# Altium schematic sheet SmartToy Main Board REV02 Block Diagram.SchDoc: Smart Toy REV01 Block Diagram
size A3; DrawnBy: Manh Ngo Van; Engineer: Manh Ngo Van; Organization: Altium Limited; Address1: L3, 12a Rodborough Rd; Address2: Frenchs Forest; Address3: NSW; Address4: Australia 2086; DocumentNumber: 1; Revision: 1.0; SheetNumber: 1; SheetTotal: 2
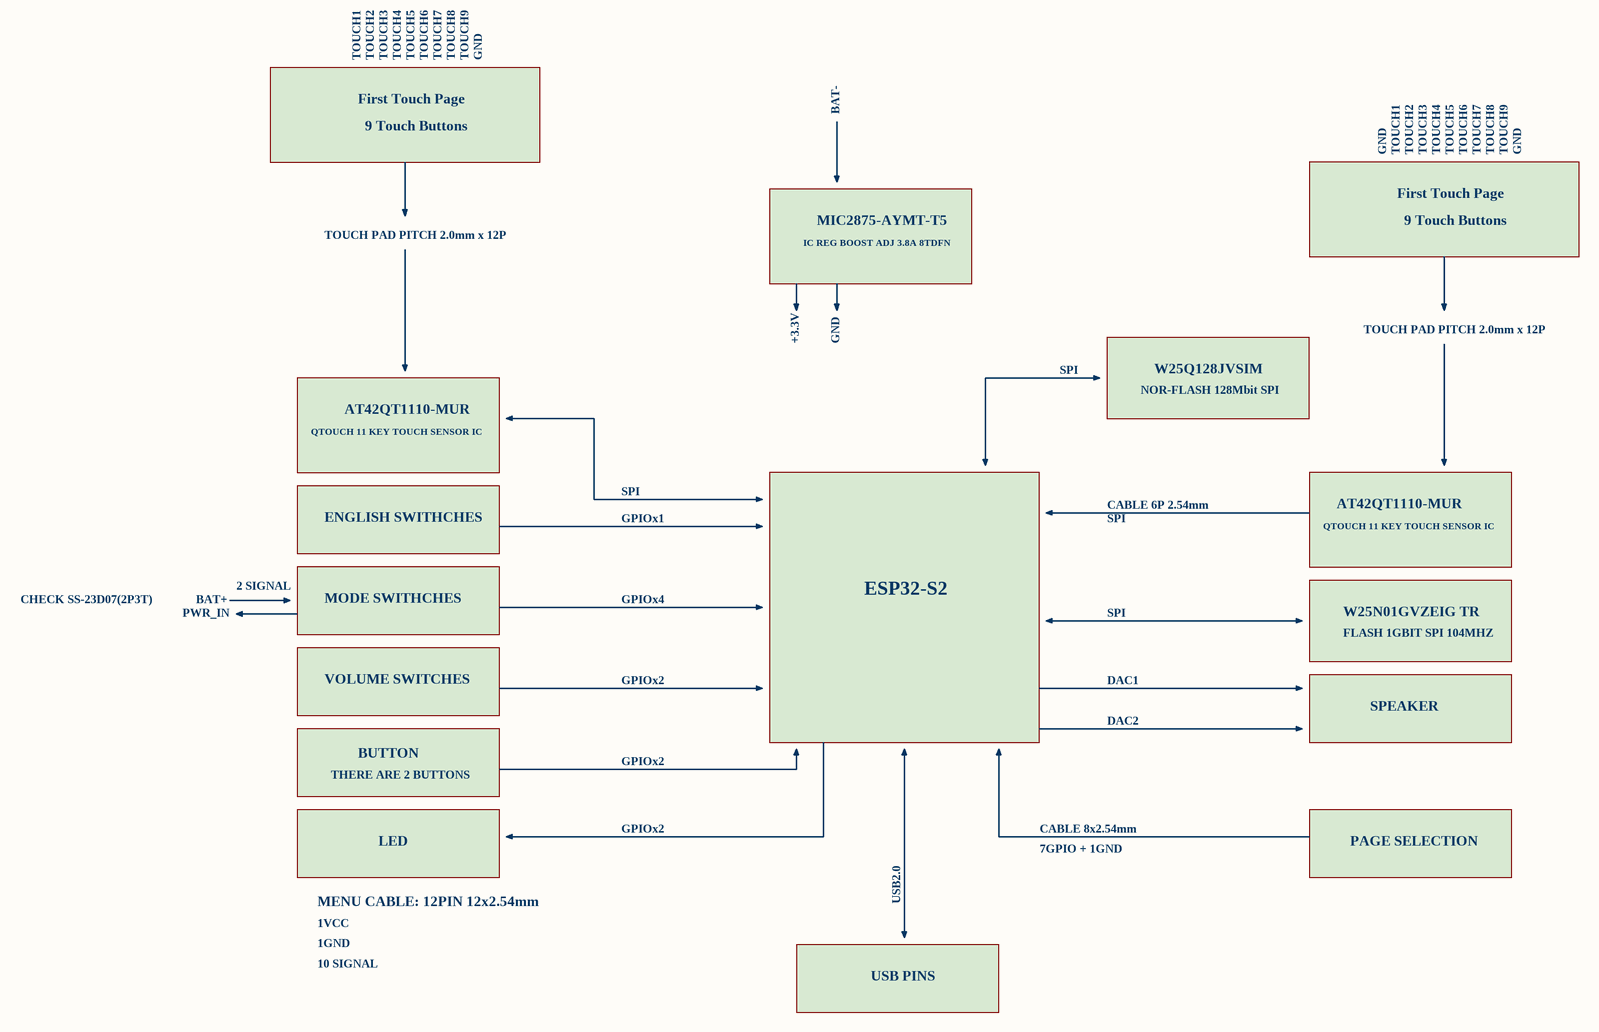
[diagram p0: SmartToy Main Board REV02 Block Diagram.SchDoc]

## Notes on the sheet
- TOUCH1
- TOUCH2
- TOUCH3
- TOUCH4
- TOUCH5
- TOUCH6
- TOUCH7
- TOUCH8
- TOUCH9
- GND
- First Touch Page
- 9 Touch Buttons
- BAT-
- MIC2875-AYMT-T5
- TOUCH PAD PITCH 2.0mm x 12P
- IC REG BOOST ADJ 3.8A 8TDFN
- +3.3V
- AT42QT1110-MUR
- SPI
- NOR-FLASH 128Mbit SPI
- W25Q128JVSIM
- QTOUCH 11 KEY TOUCH SENSOR IC
- ENGLISH SWITHCHES
- GPIOx1
- CABLE 6P 2.54mm
- CHECK SS-23D07(2P3T)
- PWR_IN
- BAT+
- 2 SIGNAL
- MODE SWITHCHES
- GPIOx4
- ESP32-S2
- W25N01GVZEIG TR
- FLASH 1GBIT SPI 104MHZ
- VOLUME SWITCHES
- GPIOx2
- DAC1
- BUTTON
- DAC2
- SPEAKER
- THERE ARE 2 BUTTONS
- CABLE 8x2.54mm
- MENU CABLE: 12PIN 12x2.54mm
- LED
- USB2.0
- 7GPIO + 1GND
- PAGE SELECTION
- 1VCC
- 1GND
- 10 SIGNAL
- USB PINS
- Address: 90 Nguyen Tuan Street, Thanh Xuan
- Hanoi - Vietnam
- Title:
- Size
- Document Number:
- Engineer:
- Drawn By:
- Rev:
- Date:
- A3
- Sheet
- of